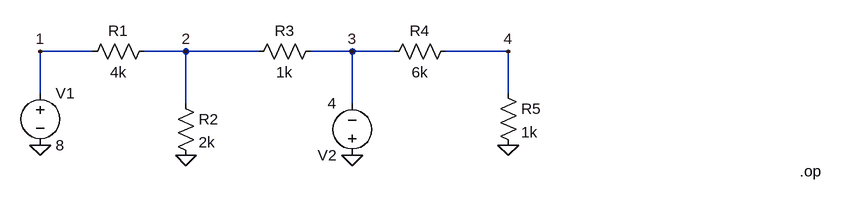
[diagram p0: schematic 1a.asc]
1a.asc, the LTspice schematic file:
Version 4
SHEET 1 1048 680
WIRE -80 -32 -160 -32
WIRE 64 -32 0 -32
WIRE 176 -32 64 -32
WIRE 320 -32 256 -32
WIRE 384 -32 320 -32
WIRE 560 -32 464 -32
WIRE -160 32 -160 -32
WIRE 560 32 560 -32
WIRE 64 48 64 -32
WIRE 320 48 320 -32
FLAG -160 112 0
FLAG 64 128 0
FLAG 320 128 0
FLAG 560 112 0
FLAG -160 -32 1
FLAG 64 -32 2
FLAG 320 -32 3
FLAG 560 -32 4
SYMBOL voltage -160 16 R0
WINDOW 123 0 0 Left 0
WINDOW 39 0 0 Left 0
SYMATTR InstName V1
SYMATTR Value 8
SYMBOL voltage 320 144 R180
WINDOW 123 0 0 Left 0
WINDOW 39 0 0 Left 0
SYMATTR InstName V2
SYMATTR Value 4
SYMBOL res 16 -48 R90
WINDOW 0 0 56 VBottom 2
WINDOW 3 32 56 VTop 2
SYMATTR InstName R1
SYMATTR Value 4k
SYMBOL res 48 32 R0
SYMATTR InstName R2
SYMATTR Value 2k
SYMBOL res 272 -48 R90
WINDOW 0 0 56 VBottom 2
WINDOW 3 32 56 VTop 2
SYMATTR InstName R3
SYMATTR Value 1k
SYMBOL res 480 -48 R90
WINDOW 0 0 56 VBottom 2
WINDOW 3 32 56 VTop 2
SYMATTR InstName R4
SYMATTR Value 6k
SYMBOL res 544 16 R0
SYMATTR InstName R5
SYMATTR Value 1k
TEXT 1008 152 Left 2 !.op

The netlist it stands for:
* 1a.asc
V1 1 0 8
V2 0 3 4
R1 2 1 4k
R2 2 0 2k
R3 3 2 1k
R4 4 3 6k
R5 4 0 1k
.op
.backanno
.end